# EAGLE schematic fb_up_2-4fach_tastsensor (EAGLE 5.00)
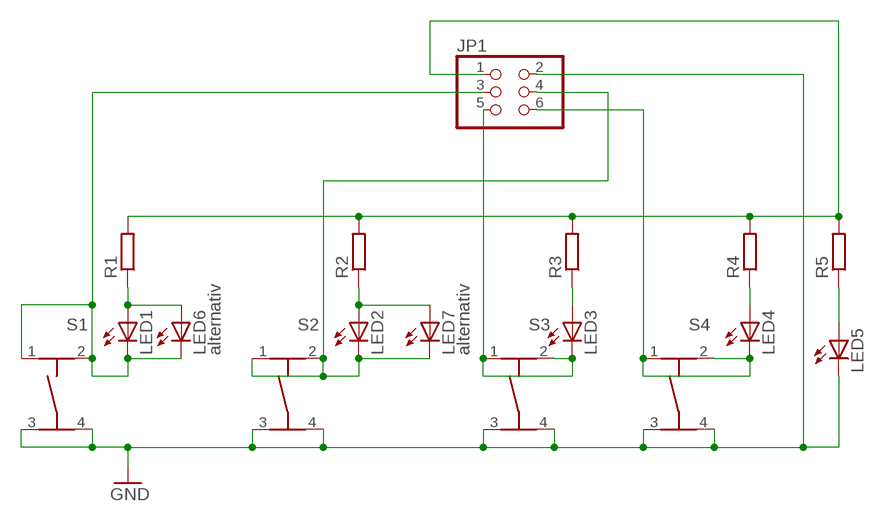
[diagram p0: schematic, sheet 1]

## Parts
JP1  PINHD-2X3  [2X03]
LED1  LED3MM  [LED3MM]
LED2  LED3MM  [LED3MM]
LED3  LED3MM  [LED3MM]
LED4  LED3MM  [LED3MM]
LED5  LED3MM  [LED3MM]
LED6  alternativ  LED3MM  [LED3MM]
LED7  alternativ  LED3MM  [LED3MM]
R1  R-EU_0204/7  [0204/7]
R2  R-EU_0204/7  [0204/7]
R3  R-EU_0204/7  [0204/7]
R4  R-EU_0204/7  [0204/7]
R5  R-EU_0204/7  [0204/7]
S1  TASTER-9314_SMD  [TASTER-9314_SMD]
S2  TASTER-9314_SMD  [TASTER-9314_SMD]
S3  TASTER-9314_SMD  [TASTER-9314_SMD]
S4  TASTER-9314_SMD  [TASTER-9314_SMD]

## Nets
GND: JP1.2 LED5.K(C) S1.3 S1.4 S2.3 S2.4 S3.3 S3.4 S4.3 S4.4
N$5: LED1.A LED6.A R1.1
N$6: LED2.A LED7.A R2.1
N$7: LED3.A R3.1
N$8: LED4.A R4.1
N$9: LED5.A R5.1
N$10: JP1.1 R1.2 R2.2 R3.2 R4.2 R5.2
N$11: JP1.3 LED1.K(C) LED6.K(C) S1.1 S1.2
N$12: JP1.4 LED2.K(C) LED7.K(C) S2.1 S2.2
N$13: JP1.5 LED3.K(C) S3.1 S3.2
N$14: JP1.6 LED4.K(C) S4.1 S4.2

## Library data of the parts
JP1 = pinhead:PINHD-2X3: PIN HEADER
LED1-LED7 = led:LED: LED OSRAM: - CHIPLED LG R971, LG N971, LY N971, LG Q971, LY Q971, LO R971, LY R971 LH N974, LH R974 LS Q976, LO Q976, LY Q976 LO Q996 - Hyper CHIPLED LW Q18S LB Q993, LB Q99A, LB R99A - SideLED LS A670, LO A670, LY A670, LG A670, LP A670 LB A673, LV A673, LT A673, LW A673 LH A674 LY A675 LS A676, LA A676, LO A676, LY A676, LW A676 LS A679, LY A679, LG A679 - Hyper Micro SIDELED® LS Y876, LA Y876, LO Y876, LY Y876 LT Y87S - SmartLED LW L88C, LW L88S LB L89C, LB L89S, LG L890 LS L89K, LO L89K, LY L89K LS L896, LA L896, LO L896, LY L896 - TOPLED LS T670, LO T670, LY T670, LG T670, LP T670 LSG T670, LSP T670, LSY T670, LOP T670, LYG T670 LG T671, LOG T671, LSG T671 LB T673, LV T673, LT T673, LW T673 LH T674 LS T676, LA T676, LO T676, LY T676, LB T676, LH T676, LSB T676, LW T676 LB T67C, LV T67C, LT T67C, LS T67K, LO T67K, LY T67K, LW E67C LS E67B, LA E67B, LO E67B, LY E67B, LB E67C, LV E67C, LT E67C LW T67C LS T679, LY T679, LG T679 LS T770, LO T770, LY T770, LG T770, LP T770 LB T773, LV T773, LT T773, LW T773 LH T774 LS E675, LA E675, LY E675, LS T675 LS T776, LA T776, LO T776, LY T776, LB T776 LHGB T686 LT T68C, LB T68C - Hyper Mini TOPLED® LB M676 - Mini TOPLED Santana® LG M470 LS M47K, LO M47K, LY M47K Source: http://www.osram.convergy.de/
R1-R5 = rcl:R-EU_: RESISTOR, European symbol
S1-S4 = Ergaenzung:TASTER-9314_SMD